# EAGLE schematic 2015Xover (EAGLE 7.6.0)
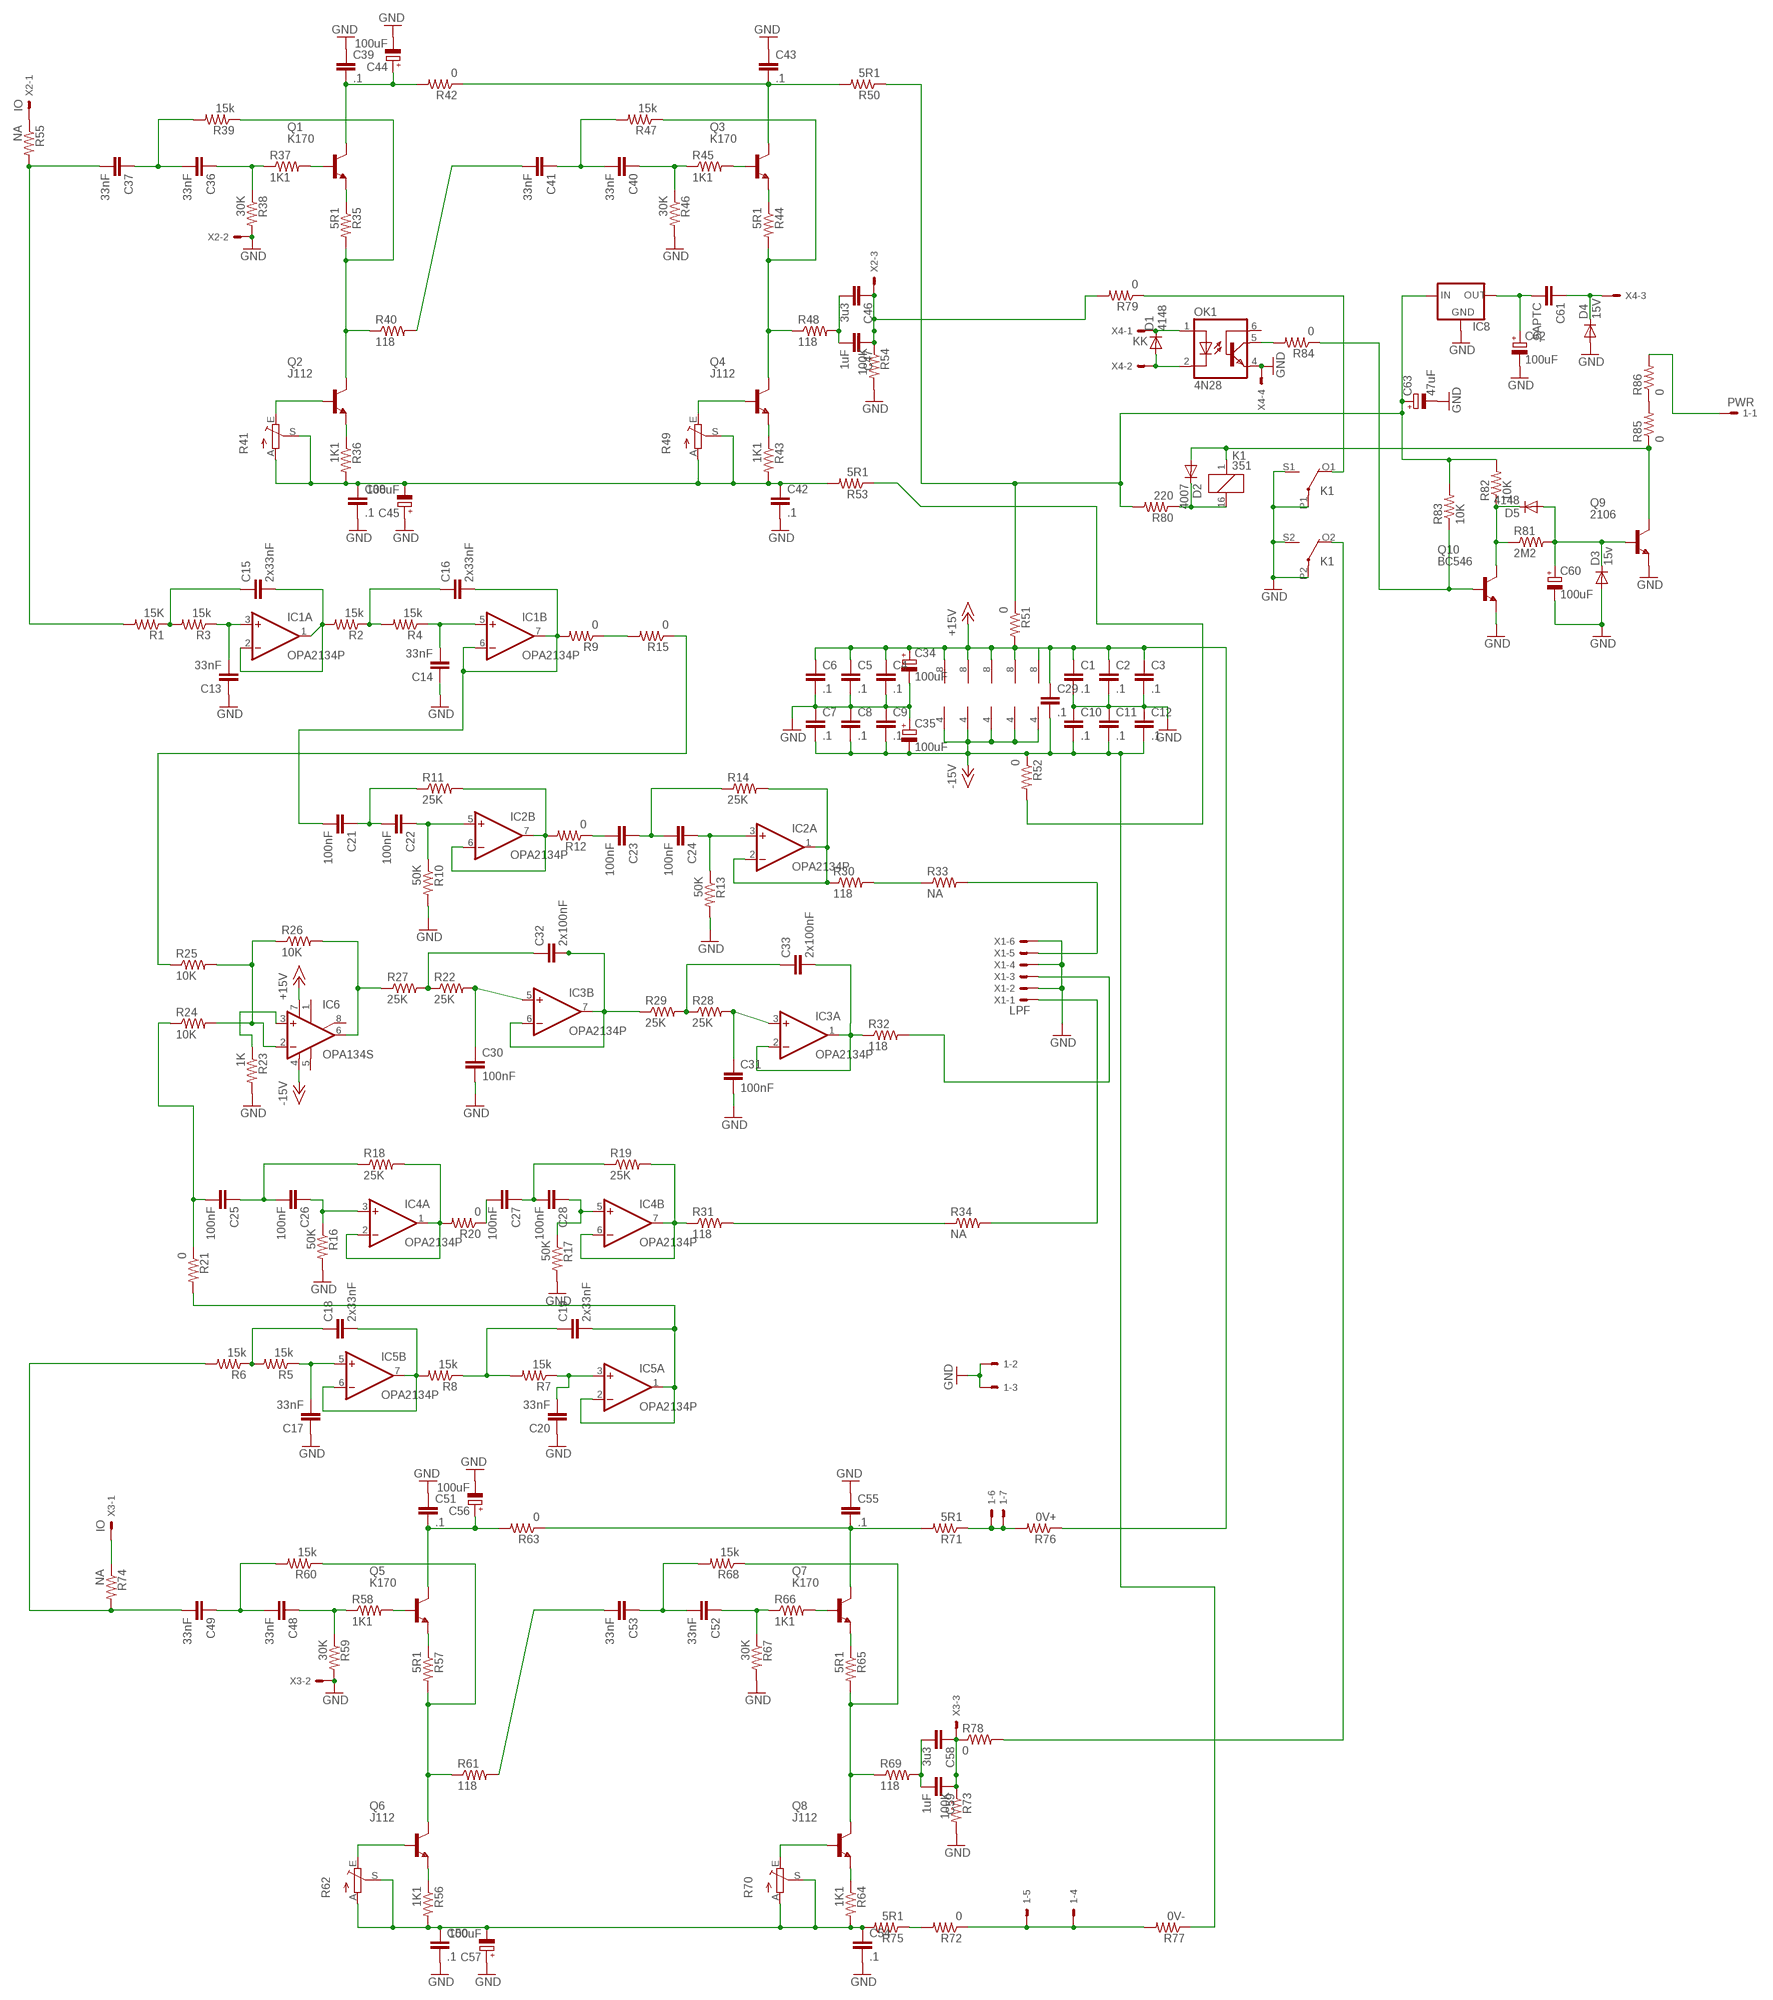
[diagram p0: schematic, sheet 1]

## Parts
1  PWR  22-23-2071  [22-23-2071]
C1  .1  C-EUC4532  [C4532]
C2  .1  C-EUC4532  [C4532]
C3  .1  C-EUC4532  [C4532]
C4  .1  C-EUC4532  [C4532]
C5  .1  C-EUC4532  [C4532]
C6  .1  C-EUC4532  [C4532]
C7  .1  C-EUC4532  [C4532]
C8  .1  C-EUC4532  [C4532]
C9  .1  C-EUC4532  [C4532]
C10  .1  C-EUC4532  [C4532]
C11  .1  C-EUC4532  [C4532]
C12  .1  C-EUC4532  [C4532]
C13  33nF  C-EU050-075X075  [C050-075X075]
C14  33nF  C-EU050-075X075  [C050-075X075]
C15  2x33nF  C-EU050-075X075  [C050-075X075]
C16  2x33nF  C-EU050-075X075  [C050-075X075]
C17  33nF  C-EU050-075X075  [C050-075X075]
C18  2x33nF  C-EU050-075X075  [C050-075X075]
C19  2x33nF  C-EU050-075X075  [C050-075X075]
C20  33nF  C-EU050-075X075  [C050-075X075]
C21  100nF  C-EU050-075X075  [C050-075X075]
C22  100nF  C-EU050-075X075  [C050-075X075]
C23  100nF  C-EU050-075X075  [C050-075X075]
C24  100nF  C-EU050-075X075  [C050-075X075]
C25  100nF  C-EU050-075X075  [C050-075X075]
C26  100nF  C-EU050-075X075  [C050-075X075]
C27  100nF  C-EU050-075X075  [C050-075X075]
C28  100nF  C-EU050-075X075  [C050-075X075]
C29  .1  C-EUC4532  [C4532]
C30  100nF  C-EU050-075X075  [C050-075X075]
C31  100nF  C-EU050-075X075  [C050-075X075]
C32  2x100nF  C-EU050-075X075  [C050-075X075]
C33  2x100nF  C-EU050-075X075  [C050-075X075]
C34  100uF  CPOL-EUE5-10.5  [E5-10,5]
C35  100uF  CPOL-EUE5-10.5  [E5-10,5]
C36  33nF  C-EU050-075X075  [C050-075X075]
C37  33nF  C-EU050-075X075  [C050-075X075]
C38  .1  C-EUC4532  [C4532]
C39  .1  C-EUC4532  [C4532]
C40  33nF  C-EU050-075X075  [C050-075X075]
C41  33nF  C-EU050-075X075  [C050-075X075]
C42  .1  C-EUC4532  [C4532]
C43  .1  C-EUC4532  [C4532]
C44  100uF  CPOL-EUE5-10.5  [E5-10,5]
C45  100uF  CPOL-EUE5-10.5  [E5-10,5]
C46  3u3  C-EU275-134X316  [C275-134X316]
C47  1uF  C-EU275-134X316  [C275-134X316]
C48  33nF  C-EU050-075X075  [C050-075X075]
C49  33nF  C-EU050-075X075  [C050-075X075]
C50  .1  C-EUC4532  [C4532]
C51  .1  C-EUC4532  [C4532]
C52  33nF  C-EU050-075X075  [C050-075X075]
C53  33nF  C-EU050-075X075  [C050-075X075]
C54  .1  C-EUC4532  [C4532]
C55  .1  C-EUC4532  [C4532]
C56  100uF  CPOL-EUE5-10.5  [E5-10,5]
C57  100uF  CPOL-EUE5-10.5  [E5-10,5]
C58  3u3  C-EU275-134X316  [C275-134X316]
C59  1uF  C-EU275-134X316  [C275-134X316]
C60  100uF  CPOL-EUE5-10.5  [E5-10,5]
C61  .5APTC  C-EU050-075X075  [C050-075X075]
C62  100uF  CPOL-EUE5-10.5  [E5-10,5]
C63  47uF  CPOL-EUE5-10.5  [E5-10,5]
D1  4148  1N4148DO35-7  [DO35-7]
D2  4007  1N4148DO35-7  [DO35-7]
D3  15v  1N4148DO35-7  [DO35-7]
D4  15V  1N4148DO35-7  [DO35-7]
D5  4148  1N4148DO35-7  [DO35-7]
IC1  OPA2134P  [DIL08]
IC2  OPA2134P  [DIL08]
IC3  OPA2134P  [DIL08]
IC4  OPA2134P  [DIL08]
IC5  OPA2134P  [DIL08]
IC6  OPA134S  OPA134P  [DIL08]
IC8  78XXS  [78XXS]
K1  351  [351]
OK1  4N28  4N35  [DIL06]
Q1  K170  BC546A  [TO92-EBC]
Q2  J112  BC546A  [TO92-EBC]
Q3  K170  BC546A  [TO92-EBC]
Q4  J112  BC546A  [TO92-EBC]
Q5  K170  BC546A  [TO92-EBC]
Q6  J112  BC546A  [TO92-EBC]
Q7  K170  BC546A  [TO92-EBC]
Q8  J112  BC546A  [TO92-EBC]
Q9  2106  BC546A  [TO92-EBC]
Q10  BC546  BC546A  [TO92-EBC]
R1  15K  R-US_0309/10  [0309/10]
R2  15k  R-US_0309/12  [0309/12]
R3  15k  R-US_0309/10  [0309/10]
R4  15k  R-US_0309/12  [0309/12]
R5  15k  R-US_0309/10  [0309/10]
R6  15k  R-US_0309/10  [0309/10]
R7  15k  R-US_0309/10  [0309/10]
R8  15k  R-US_0309/12  [0309/12]
R9  0  R-US_0309/12  [0309/12]
R10  50K  R-US_0309/10  [0309/10]
R11  25K  R-US_0309/10  [0309/10]
R12  0  R-US_0309/12  [0309/12]
R13  50K  R-US_0309/12  [0309/12]
R14  25K  R-US_0309/10  [0309/10]
R15  0  R-US_0309/12  [0309/12]
R16  50K  R-US_0309/12  [0309/12]
R17  50K  R-US_0309/10  [0309/10]
R18  25K  R-US_0309/10  [0309/10]
R19  25K  R-US_0309/10  [0309/10]
R20  0  R-US_0309/12  [0309/12]
R21  0  R-US_0309/10  [0309/10]
R22  25K  R-US_0309/10  [0309/10]
R23  1K  R-US_0309/10  [0309/10]
R24  10K  R-US_0309/10  [0309/10]
R25  10K  R-US_0309/12  [0309/12]
R26  10K  R-US_0309/12  [0309/12]
R27  25K  R-US_0309/10  [0309/10]
R28  25K  R-US_0309/10  [0309/10]
R29  25K  R-US_0309/12  [0309/12]
R30  118  R-US_0309/10  [0309/10]
R31  118  R-US_0309/12  [0309/12]
R32  118  R-US_0309/10  [0309/10]
R33  NA  R-US_0309/10  [0309/10]
R34  NA  R-US_0309/10  [0309/10]
R35  5R1  R-US_0309/10  [0309/10]
R36  1K1  R-US_R1210  [R1210]
R37  1K1  R-US_R1210  [R1210]
R38  30K  R-US_0309/10  [0309/10]
R39  15k  R-US_0309/10  [0309/10]
R40  118  R-US_0309/10  [0309/10]
R41  TRIM_EU-RJ9W  [RJ9W]
R42  0  R-US_0309/10  [0309/10]
R43  1K1  R-US_R1210  [R1210]
R44  5R1  R-US_0309/10  [0309/10]
R45  1K1  R-US_R1210  [R1210]
R46  30K  R-US_0309/10  [0309/10]
R47  15k  R-US_0309/10  [0309/10]
R48  118  R-US_0309/10  [0309/10]
R49  TRIM_EU-RJ9W  [RJ9W]
R50  5R1  R-US_0309/10  [0309/10]
R51  0  R-US_0309/10  [0309/10]
R52  0  R-US_0309/10  [0309/10]
R53  5R1  R-US_0309/10  [0309/10]
R54  100K  R-US_0309/10  [0309/10]
R55  NA  R-US_0309/12  [0309/12]
R56  1K1  R-US_R1210  [R1210]
R57  5R1  R-US_0309/10  [0309/10]
R58  1K1  R-US_R1210  [R1210]
R59  30K  R-US_0309/10  [0309/10]
R60  15k  R-US_0309/10  [0309/10]
R61  118  R-US_0309/10  [0309/10]
R62  TRIM_EU-RJ9W  [RJ9W]
R63  0  R-US_0309/10  [0309/10]
R64  1K1  R-US_R1210  [R1210]
R65  5R1  R-US_0309/10  [0309/10]
R66  1K1  R-US_R1210  [R1210]
R67  30K  R-US_0309/10  [0309/10]
R68  15k  R-US_0309/10  [0309/10]
R69  118  R-US_0309/10  [0309/10]
R70  TRIM_EU-RJ9W  [RJ9W]
R71  5R1  R-US_0309/10  [0309/10]
R72  0  R-US_0309/12  [0309/12]
R73  100K  R-US_0309/10  [0309/10]
R74  NA  R-US_0309/12  [0309/12]
R75  5R1  R-US_0309/10  [0309/10]
R76  0V+  R-US_0309/10  [0309/10]
R77  0V-  R-US_0309/12  [0309/12]
R78  0  R-US_0309/12  [0309/12]
R79  0  R-US_0309/10  [0309/10]
R80  220  R-US_0309/10  [0309/10]
R81  2M2  R-US_0207/10  [0207/10]
R82  10K  R-US_0207/10  [0207/10]
R83  10K  R-US_0207/10  [0207/10]
R84  0  R-US_0309/10  [0309/10]
R85  0  R-US_0207/12  [0207/12]
R86  0  R-US_0207/10  [0207/10]
X1  LPF  22-23-2061  [22-23-2061]
X2  IO  22-23-2031  [22-23-2031]
X3  IO  22-23-2031  [22-23-2031]
X4  KK  22-23-2041  [22-23-2041]

## Nets
+15V: C1.1 C2.1 C3.1 C4.1 C5.1 C6.1 C29.1 C34.+ IC1.8(P:V+) IC2.8(P:V+) IC3.8(P:V+) IC4.8(P:V+) IC5.8(P:V+) IC6.7(V+) R51.2 R76.1
-15V: C7.2 C8.2 C9.2 C10.2 C11.2 C12.2 C29.2 C35.- IC1.4(P:V-) IC2.4(P:V-) IC3.4(P:V-) IC4.4(P:V-) IC5.4(P:V-) IC6.4(V-) R52.1 R77.1
GND: 1.2 1.3 C1.2 C2.2 C3.2 C4.2 C5.2 C6.2 C7.1 C8.1 C9.1 C10.1 C11.1 C12.1 C13.1 C14.1 C17.1 C20.1 C30.2 C31.2 C34.- C35.+ C38.2 C39.1 C42.2 C43.1 C44.- C45.+ C50.2 C51.1 C54.2 C55.1 C56.- C57.+ C60.- C62.- C63.- D3.A D4.A IC8.GND K1.P1(2:P) K1.P2(3:P) K1.S1(2:S) K1.S2(3:S) OK1.4(EMI) Q9.E Q10.E R10.2 R13.2 R16.2 R17.2 R23.2 R38.2 R46.2 R54.2 R59.2 R67.2 R73.2 X1.2 X1.4 X1.6 X2.2 X3.2 X4.4
N$1: C15.2 IC1.1(A:OUT) IC1.2(A:-IN) R2.2
N$2: C23.1 C24.2 R14.1
N$3: IC2.1(A:OUT) IC2.2(A:-IN) R14.2 R30.1
N$4: IC2.6(B:-IN) IC2.7(B:OUT) R11.2 R12.2
N$5: C33.2 IC3.1(A:OUT) IC3.2(A:-IN) R32.1
N$6: C32.2 IC3.6(B:-IN) IC3.7(B:OUT) R29.1
N$7: Q2.E R36.1
N$8: IC4.6(B:-IN) IC4.7(B:OUT) R19.2 R31.1
N$9: C18.2 IC5.6(B:-IN) IC5.7(B:OUT) R8.2
N$10: C19.2 IC5.1(A:OUT) IC5.2(A:-IN) R21.2
N$11: C16.1 R2.1 R4.2
N$12: C15.1 R1.1 R3.2
N$13: C13.2 IC1.3(A:+IN) R3.1
N$14: C14.2 IC1.5(B:+IN) R4.1
N$16: C18.1 R5.2 R6.1
N$17: C17.2 IC5.5(B:+IN) R5.1
N$18: C20.2 IC5.3(A:+IN) R7.1
N$19: C19.1 R7.2 R8.1
N$20: C21.1 C22.2 R11.1
N$21: C22.1 IC2.5(B:+IN) R10.1
N$22: C16.2 C21.2 IC1.6(B:-IN) IC1.7(B:OUT) R9.2
N$23: C24.1 IC2.3(A:+IN) R13.1
N$24: C23.2 R12.1
N$25: R9.1 R15.2
N$26: C27.2 R20.1
N$27: C27.1 C28.2 R19.1
N$28: C28.1 IC4.5(B:+IN) R17.1
N$29: C26.1 IC4.3(A:+IN) R16.1
N$30: C25.1 C26.2 R18.1
N$31: R30.2 R33.1
N$32: R31.2 R34.1
N$33: Q2.C R35.2 R39.1 R40.1
N$34: IC4.1(A:OUT) IC4.2(A:-IN) R18.2 R20.2
N$35: Q1.E R35.1
N$36: C49.2 R6.2 R74.2
N$37: C39.2 C44.+ Q1.C R42.2
N$38: IC6.2(-IN) R24.2 R25.2 R26.1
N$39: IC6.6(OUT) R26.2 R27.1
N$40: C25.2 R21.1 R24.1
N$41: R15.1 R25.1
N$42: Q1.B R37.2
N$43: C31.1 IC3.3(A:+IN) R28.2
N$44: C30.1 IC3.5(B:+IN) R22.2
N$45: C32.1 R22.1 R27.2
N$46: C33.1 R28.1 R29.2
N$47: Q2.B R41.E
N$48: C36.1 R37.1 R38.1
N$49: R34.2 X1.1
N$50: R32.2 X1.3
N$51: R33.2 X1.5
N$52: C36.2 C37.1 R39.2
N$53: C37.2 R1.2 R55.2
N$54: C41.2 R40.2
N$55: IC6.3(+IN) R23.1
N$56: C38.1 C42.1 C45.- R36.2 R41.A R41.S R43.2 R49.A R49.S R53.2
N$57: Q4.E R43.1
N$58: Q4.C R44.2 R47.1 R48.1
N$59: Q3.E R44.1
N$60: C43.2 Q3.C R42.1 R50.2
N$61: Q3.B R45.2
N$62: Q4.B R49.E
N$63: C40.1 R45.1 R46.1
N$64: C40.2 C41.1 R47.2
N$65: R52.2 R53.1
N$66: OK1.5(COL) R84.2
N$67: C46.2 C47.2 R48.2
N$68: C46.1 C47.1 R54.1 R79.2 X2.3
N$69: R55.1 X2.1
N$70: 1.6 1.7 R71.1 R76.2
N$71: Q6.E R56.1
N$72: Q6.C R57.2 R60.1 R61.1
N$73: Q5.E R57.1
N$74: C51.2 C56.+ Q5.C R63.2
N$75: Q5.B R58.2
N$76: Q6.B R62.E
N$77: C48.1 R58.1 R59.1
N$78: C48.2 C49.1 R60.2
N$79: C50.1 C54.1 C57.- R56.2 R62.A R62.S R64.2 R70.A R70.S R75.2
N$80: C53.2 R61.2
N$81: Q8.E R64.1
N$82: Q8.C R65.2 R68.1 R69.1
N$83: Q7.E R65.1
N$84: C55.2 Q7.C R63.1 R71.2
N$85: Q7.B R66.2
N$86: Q8.B R70.E
N$87: C52.1 R66.1 R67.1
N$88: C52.2 C53.1 R68.2
N$89: D1.C OK1.1(A) X4.1
N$90: R72.2 R75.1
N$91: C58.2 C59.2 R69.2
N$92: C58.1 C59.1 R73.1 R78.1 X3.3
N$93: R74.1 X3.1
N$94: 1.4 1.5 R72.1 R77.2
N$95: D1.A OK1.2(C) X4.2
N$96: K1.O1(2:O) R79.1
N$97: D2.C K1.16 R80.1
N$98: C60.+ D3.C D5.A Q9.B R81.2
N$99: K1.O2(3:O) R78.2
N$100: D2.A K1.1 Q9.C R85.1
N$101: C61.1 D4.C X4.3
N$102: C61.2 C62.+ IC8.OUT
N$103: D5.C Q10.C R81.1 R82.1
N$104: Q10.B R83.1 R84.1
N$105: C63.+ IC8.IN R50.1 R51.1 R80.2 R82.2 R83.2
N$106: R85.2 R86.1
N$107: 1.1 R86.2
Unconnected: IC6.1(ON1) IC6.5(OPT) IC6.8(ON2) OK1.6(BAS)

## Library data of the parts
1 = con-molex:22-23-2071: .100" (2.54mm) Center Header - 7 Pin; MF: MOLEX; MPN: 22-23-2071; OC_FARNELL: 1654534; OC_NEWARK: 56H0445
C1-C33 C36-C43 C46-C55 C58 C59 C61 = resistor:C-EU: CAPACITOR, European symbol
C34 C35 C44 C45 C56 C57 C60 C62 C63 = resistor:CPOL-EU: POLARIZED CAPACITOR, European symbol
D1-D5 = diode:1N4148: DIODE high speed (Philips)
IC1-IC5 = linear:OPA2134: SoundPLUS (TM) High Performance AUDIO OPERATIONAL AMPLIFIERS Source: http://focus.ti.com/lit/ds/sbos058/sbos058.pdf
IC6 = linear:OPA134: AUDIO AMPLIFIER
IC8 = v-reg:78XXS: VOLTAGE REGULATOR
K1 = relay:351: RELAY 2 x switch, Omron; OC_FARNELL: unknown; OC_NEWARK: unknown
OK1 = optocoupler:4N35: MOTOROLA OPTO COUPLER; MF: FAIRCHILD SEMICONDUCTOR; MPN: 4N35; OC_FARNELL: 1328375; OC_NEWARK: 72K9946
Q1-Q10 = transistor-npn:BC546*: NPN Transistor
R1-R40 R42-R48 R50-R61 R63-R69 R71-R86 = resistor:R-US_: RESISTOR, American symbol
R41 R49 R62 R70 = pot:TRIM_EU-: POTENTIOMETER
X1 = con-molex:22-23-2061: .100" (2.54mm) Center Header - 6 Pin; MF: MOLEX; MPN: 22-23-2061; OC_FARNELL: 1462922; OC_NEWARK: 27C1933
X2 X3 = con-molex:22-23-2031: .100" (2.54mm) Center Header - 3 Pin; MF: MOLEX; MPN: 22-23-2031; OC_FARNELL: 1462950; OC_NEWARK: 30C0862
X4 = con-molex:22-23-2041: .100" (2.54mm) Center Header - 4 Pin; MF: MOLEX; MPN: 22-23-2041; OC_FARNELL: 1462920; OC_NEWARK: 38C0355